# EAGLE design hashlet_pi (EAGLE 6.5.0)
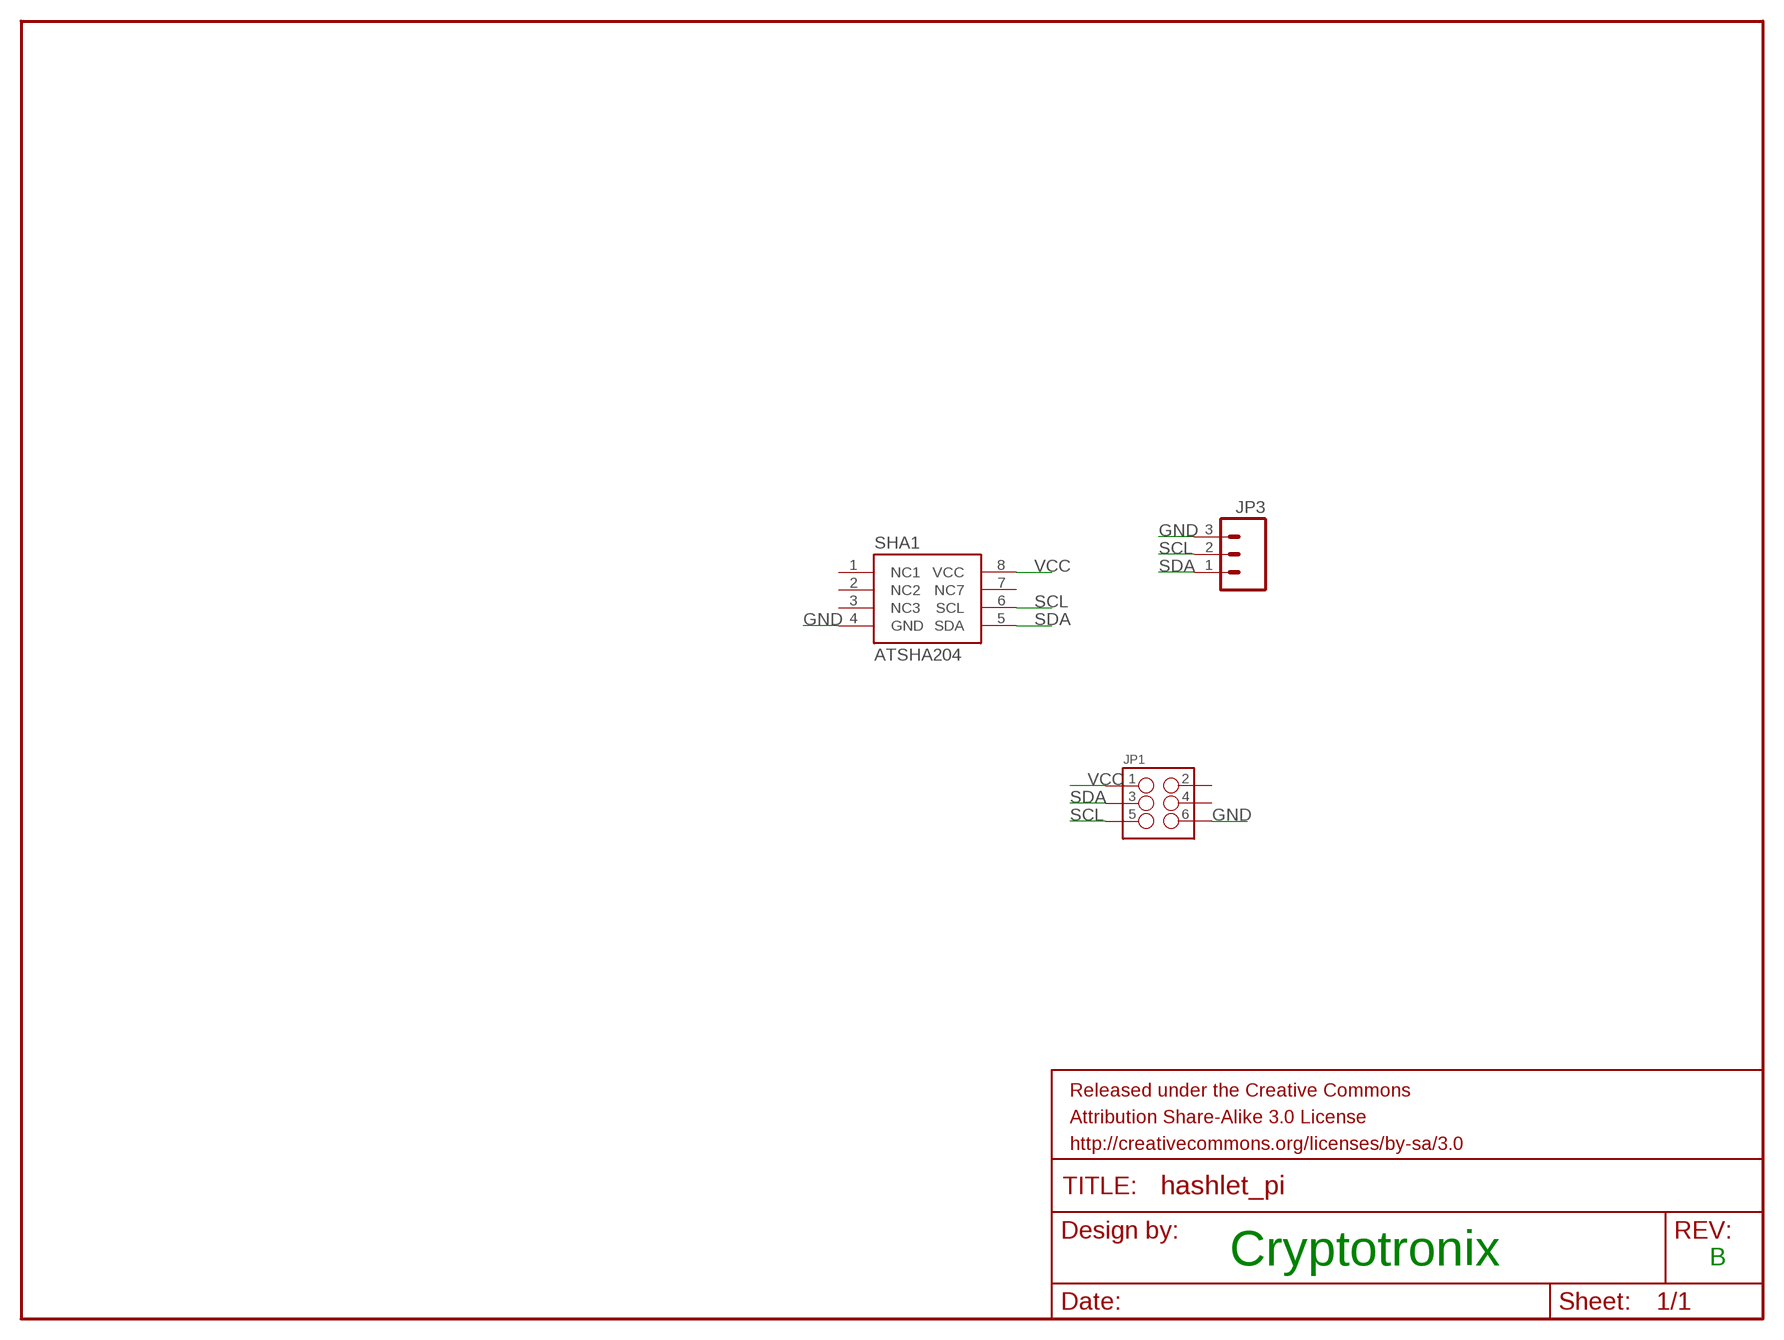
[diagram p0: schematic, sheet 1]

## Parts
FRAME1  FRAME-LETTER  [CREATIVE_COMMONS]
JP1  M03X22X3_SILK_SM  [2X3]
JP3  M03PTH  [1X03]
SHA1  ATSHA204  [SOIC8]

## Nets
GND: JP1.6 JP3.3 SHA1.4(GND)
SCL: JP1.5 JP3.2 SHA1.6(SCL)
SDA: JP1.3 JP3.1 SHA1.5(SDA)
VCC: JP1.1 SHA1.8(VCC)
Unconnected: JP1.2 JP1.4 SHA1.1(NC1) SHA1.2(NC2) SHA1.3(NC3) SHA1.7(NC7)

## Notes on the sheet
- Cryptotronix | B

## Library data of the parts
FRAME1 = SparkFun-Aesthetics:FRAME-LETTER: Schematic Frame Standard 8.5x11 US Letter frame
JP1 = SparkFun-Connectors:M03X2: 2x3 .1" header. Shrouded, with keying- CONN-10681 SMT- CONN-11415 Pogo pins- HW-11044
JP3 = SparkFun-Connectors:M03: Header 3 Standard 3-pin 0.1" header. Use with straight break away headers (SKU : PRT-00116), right angle break away headers (PRT-00553), swiss pins (PRT-00743), machine pins (PRT-00117), and female headers (PRT-00115). Molex polarized connector foot print use with SKU : PRT-08232 with associated crimp pins and housings.
SHA1 = cryptotronix:ATSHA204: ATSHA204

## Board
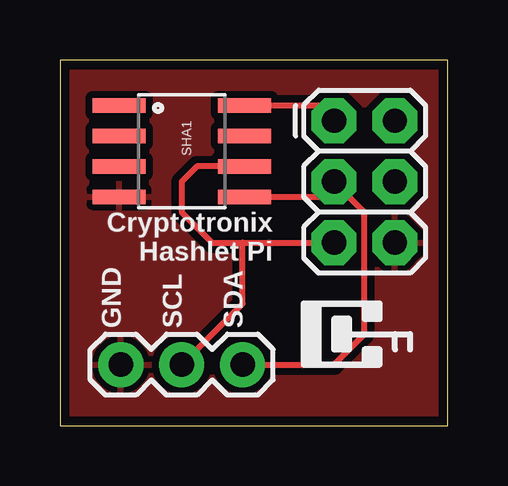
[diagram p1: board, top side]
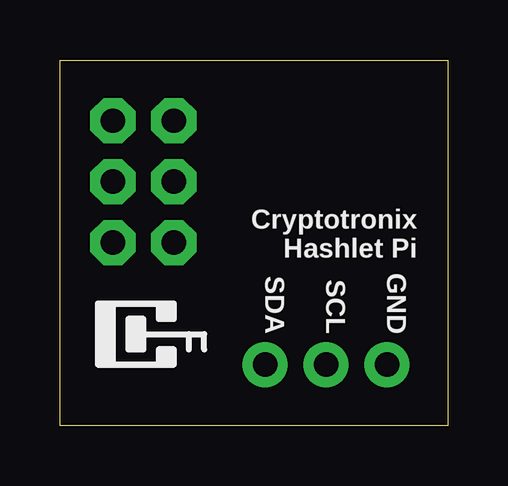
[diagram p2: board, bottom side, seen from below]

Size 16.18 x 15.23 mm. Coordinates in mm from the lower left corner, seen from the top.
Outline: 0,0 16.18,0 16.18,15.23 0,15.23 0,0
Copper layers (1*16): Top 0.0356mm / dielectric 1.5011mm / Bottom 0.0356mm
Design rules "LaenPCBOrder": minimum track width 6mil, minimum drill 13mil, track to track 6mil, track to pad 6mil, pad to pad 6mil, via to via 6mil, smd to smd 6mil, copper to edge 15mil, drill to drill 6mil, minimum pad ring 7mil, minimum via ring 7mil, stop-mask expansion 3mil, vias tented up to drill 0mil, thermal gap 10mil

### Footprints (pad centres in the part's own frame; a part is rotated, then mirrored left to right if it is on the bottom)
2X3 = drill 1.016 pad 1.88 octagon: 1 0,0; 2 0,2.54; 3 2.54,0; 4 2.54,2.54; 5 5.08,0; 6 5.08,2.54
1X03 = drill 1.016 pad 1.88: 1 0,0; 2 2.54,0; 3 5.08,0
SOIC8 = smd 0.61 x 2.21: 1 -1.905,-2.616; 2 -0.635,-2.616; 3 0.635,-2.616; 4 1.905,-2.616; 5 1.905,2.616; 6 0.635,2.616; 7 -0.635,2.616; 8 -1.905,2.616

### Placement (x,y rotation side)
FRAME1  20.32,-7.62 0 top  (outside the outline)
JP1  11.43,12.7 270 top
JP3  7.62,2.54 180 top
SHA1  5.08,11.43 270 top

### Tracks (layer width: path | path; a pad name or v marks a point on that pad's centre or on a via)
GND
  pour Top (isolate 0.305): 0,15.24 16.51,15.24 16.51,0 0,0
SCL
  Top 0.254: SHA1.6 5.71,10.79 5.08,10.16 5.08,8.89 6.35,7.62 7.62,7.62 | 7.62,7.62 JP1.5 | JP3.2 7.62,5.08 7.62,7.62
SDA
  Top 0.254: SHA1.5 10.79,9.53 JP1.3 12.7,8.89 12.7,3.81 11.43,2.54 JP3.1
VCC
  Top 0.254: SHA1.8 10.79,13.34 JP1.1

### Text on the board
tPlace: Cryptotronix / Hashlet Pi | GND | SCL | SDA | Cryptotronix
bPlace: Cryptotronix / Hashlet Pi | GND | SCL | SDA